# EAGLE schematic CAN_Base_V1 (EAGLE 9.7.0)
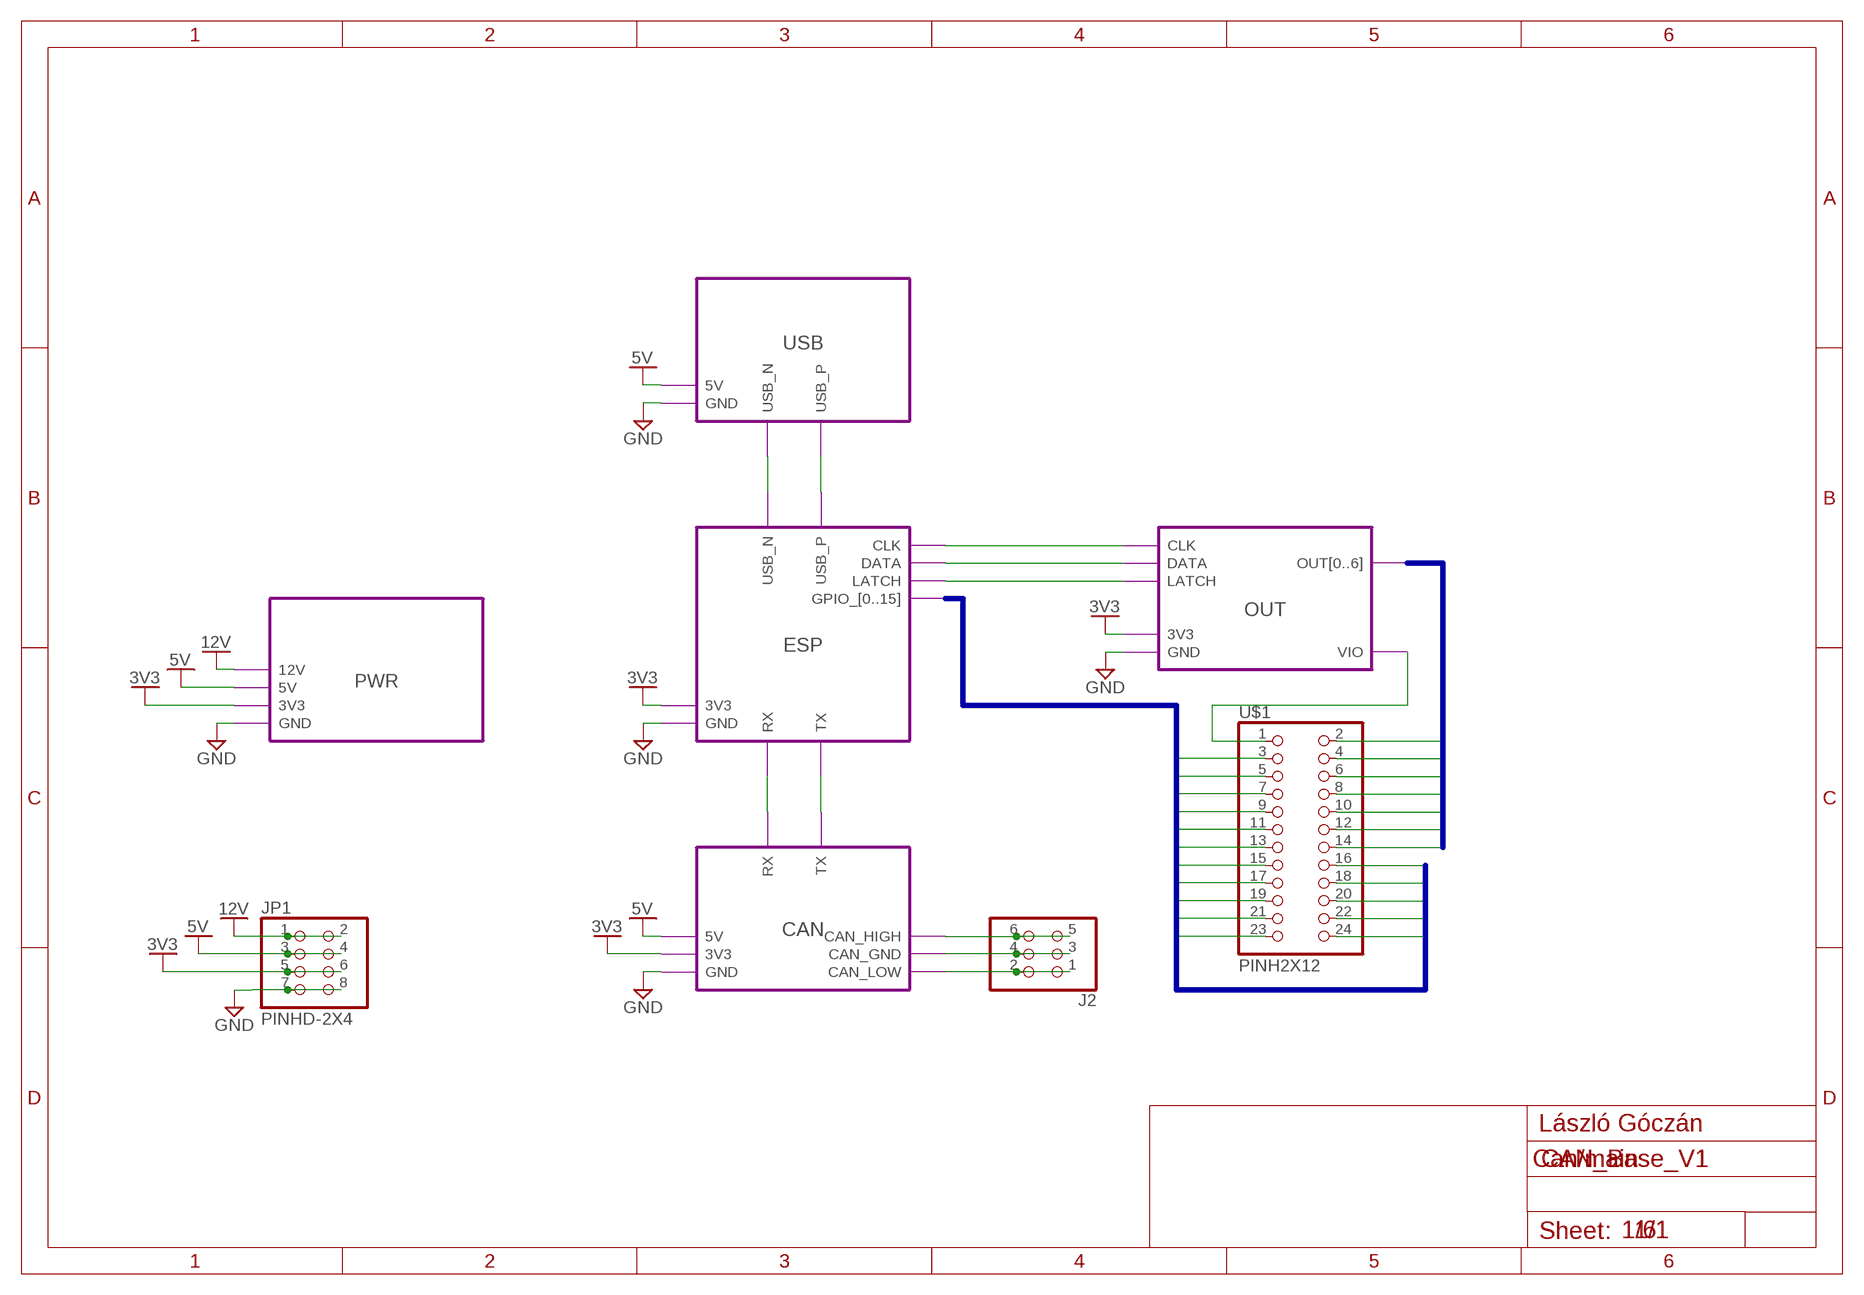
[diagram p0: schematic, sheet 1]

## Parts
J2  PINHD-2X3  [2X03]
JP1  PINHD-2X4  [2X04]
U$1  PINH2X12  [2X12]

## Module instances
ESP = ESP32_C6_WROOM_1_N8
USB = USB
CAN = CAN
OUT = 500MA_OUT_AND_7_SEGMENT
PWR = POWER

## Nets
3V3: JP1.5 JP1.6 ; port PWR.3V3 CAN.3V3 ESP.3V3 OUT.3V3
5V: JP1.3 JP1.4 ; port PWR.5V CAN.5V
12V: JP1.1 JP1.2 ; port PWR.12V
CAN_GND: J2.3 J2.4 ; port CAN.CAN_GND
CAN_HIGH: J2.5 J2.6 ; port CAN.CAN_HIGH
CAN_LOW: J2.1 J2.2 ; port CAN.CAN_LOW
GND: JP1.7 JP1.8 ; port PWR.GND ESP.GND CAN.GND USB.GND OUT.GND
GPIO0: U$1.16
GPIO1: U$1.18
GPIO2: U$1.20
GPIO3: U$1.22
GPIO4: U$1.24
GPIO5: U$1.23
GPIO6: U$1.21
GPIO7: U$1.19
GPIO8: U$1.17
GPIO9: U$1.15
GPIO10: U$1.13
GPIO11: U$1.11
GPIO12: U$1.9
GPIO13: U$1.7
GPIO14: U$1.5
GPIO15: U$1.3
N$1: U$1.1 ; port OUT.VIO
N$5: port ESP.CLK OUT.CLK
N$6: port ESP.DATA OUT.DATA
N$7: port ESP.LATCH OUT.LATCH
OUT0: U$1.2
OUT1: U$1.4
OUT2: U$1.6
OUT3: U$1.8
OUT4: U$1.10
OUT5: U$1.12
OUT6: U$1.14
RX: port CAN.RX ESP.RX
TX: port CAN.TX ESP.TX
USB_N: port USB.USB_N ESP.USB_N
USB_P: port ESP.USB_P USB.USB_P

## Buses
OUT[0..6]
GPIO[0..15]

## Notes on the sheet
- László Góczán
- Can/main
- 1/6

## Library data of the parts
J2 = SparkFun-Retired:PINHD-2X3: PIN HEADER
JP1 = Connector:PINHD-2X4: PIN HEADER; CATEGORY: Headers; DESCRIPTION: Header, Straight, 2x4 Position; MANUFACTURER: Generic; MPN: Generic; OPERATING_TEMPERATURE: Generic; PART_STATUS: Active; PITCH: 0.100" (2.54mm); ROHS_COMPLIANCE: Generic; SERIES: Generic; SUB-CATEGORY: Headers, Male Pins; TYPE: Board to Board or Cable, Unshrouded, Through Hole, Straight
U$1 = SparkFun-Retired:PINH2X12

## Module ESP32_C6_WROOM_1_N8
Ports: TX(io) RX(io) GND(pwr) 3V3(pwr) CLK(io) DATA(io) LATCH(io) GPIO_[0..15](io) USB_N(io) USB_P(io)
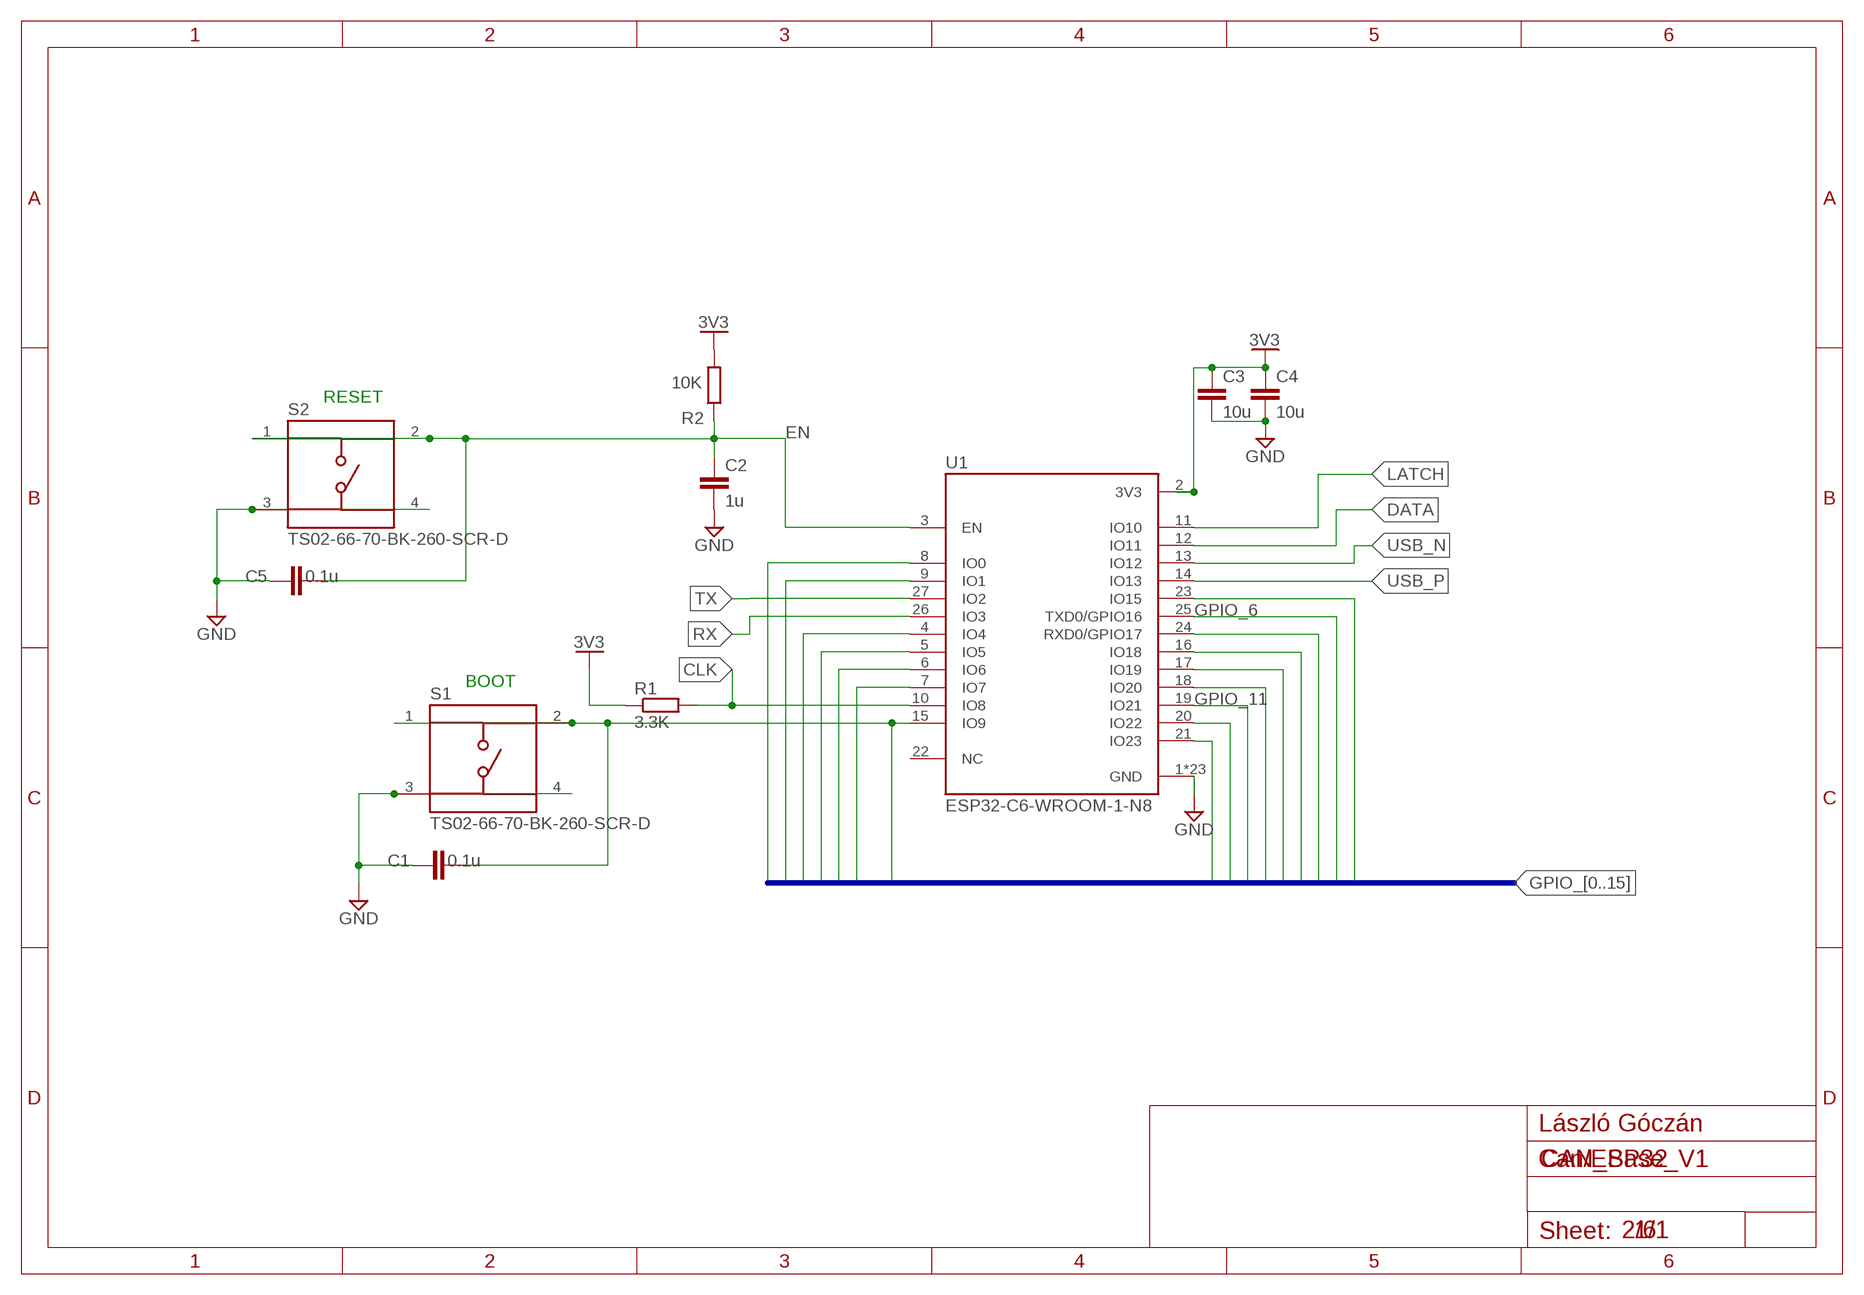
[diagram p1: schematic, module ESP32_C6_WROOM_1_N8, sheet 1]

### Parts
C1  0.1u  C-EUC0603  [C0603]
C2  1u  C-EUC0603  [C0603]
C3  10u  C-EUC0805  [C0805]
C4  10u  C-EUC0805  [C0805]
C5  0.1u  C-EUC0603  [C0603]
R1  3.3K  R-EU_R0603  [R0603]
R2  10K  R-EU_R0603  [R0603]
S1  TS02-66-70-BK-260-SCR-D  [SW_TS02-66-70-BK-260-SCR-D]
S2  TS02-66-70-BK-260-SCR-D  [SW_TS02-66-70-BK-260-SCR-D]
U1  ESP32-C6-WROOM-1-N8  [XCVR_ESP32-C6-WROOM-1-N8]

### Nets
3V3: C3.1 C4.1 R1.1 R2.2 U1.2(3V3)
CLK: R1.2 U1.10(IO8)
DATA: U1.12(IO11)
EN: C2.1 C5.2 R2.1 S2.1 S2.2 U1.3(EN)
GND: C1.1 C2.2 C3.2 C4.2 C5.1 S1.3 S1.4 S2.3 S2.4 U1.1(GND) U1.28(GND) U1.29_1(GND) U1.29_2(GND) U1.29_3(GND) U1.29_4(GND) U1.29_5(GND) U1.29_6(GND) U1.29_7(GND) U1.29_8(GND) U1.29_9(GND) U1.30_1(GND) U1.30_2(GND) U1.30_3(GND) U1.30_4(GND) U1.30_5(GND) U1.30_6(GND) U1.30_7(GND) U1.30_8(GND) U1.30_9(GND) U1.30_10(GND) U1.30_11(GND) U1.30_12(GND)
GPIO_0: U1.9(IO1)
GPIO_1: U1.8(IO0)
GPIO_2: U1.7(IO7)
GPIO_3: U1.6(IO6)
GPIO_4: U1.5(IO5)
GPIO_5: U1.4(IO4)
GPIO_6: U1.25(TXD0/GPIO16)
GPIO_7: C1.2 S1.1 S1.2 U1.15(IO9)
GPIO_8: U1.16(IO18)
GPIO_9: U1.17(IO19)
GPIO_10: U1.18(IO20)
GPIO_11: U1.19(IO21)
GPIO_12: U1.20(IO22)
GPIO_13: U1.21(IO23)
GPIO_14: U1.23(IO15)
GPIO_15: U1.24(RXD0/GPIO17)
LATCH: U1.11(IO10)
RX: U1.26(IO3)
TX: U1.27(IO2)
USB_N: U1.13(IO12)
USB_P: U1.14(IO13)
Unconnected: U1.22(NC)

### Buses
GPIO_[0..15]

### Notes on the sheet
- RESET
- BOOT
- László Góczán
- Can/ESP32
- 2/6

### Library data of the parts
C1-C5 = resistor:C-EU: CAPACITOR, European symbol
R1 R2 = resistor:R-EU_: RESISTOR, European symbol
S1 S2 = TS02-66-70-BK-260-SCR-D:TS02-66-70-BK-260-SCR-D: Check availability; AVAILABILITY: In Stock; CHECK_PRICES: https://www.snapeda.com/parts/TS02-66-70-BK-260-SCR-D/CUI+Devices/view-part/?ref=eda; CUI_PURCHASE_URL: https://www.cuidevices.com/product/switches/tactile-switches/ts02-66-70-bk-260-scr-d?utm_source=snapeda.com&utm_medium=referral&utm_campaign=snapedaBOM; DESCRIPTION: 6 x 6 mm, 7 mm Actuator Height, 260 gf, Black, Short Crimped, Through Hole, SPST, Tactile Switch; MF: CUI Devices; MP: TS02-66-70-BK-260-SCR-D; PACKAGE: None; PRICE: None; PURCHASE-URL: https://www.snapeda.com/api/url_track_click_mouser/?unipart_id=8666189&manufacturer=CUI Devices&part_name=TS02-66-70-BK-260-SCR-D&search_term=ts02-66; SNAPEDA_LINK: https://www.snapeda.com/parts/TS02-66-70-BK-260-SCR-D/CUI+Devices/view-part/?ref=snap
U1 = ESP32-FIXED:ESP32-C6-WROOM-1-N8: Check availability; AVAILABILITY: In Stock; CHECK_PRICES: https://www.snapeda.com/parts/ESP32-C6-WROOM-1-N8/Espressif+Systems/view-part/?ref=eda; DESCRIPTION: Multiprotocol Modules ESP32-C6 module, Wi-Fi 6 in 2.4 GHz band, Bluetooth 5, Zigbee 3.0 and Thread. ESP34-WROOM Compatible - ENGINEERING SAMPLE; MF: Espressif Systems; MP: ESP32-C6-WROOM-1-N8; PACKAGE: None; PRICE: None; PURCHASE-URL: https://www.snapeda.com/api/url_track_click_mouser/?unipart_id=12616380&manufacturer=Espressif Systems&part_name=ESP32-C6-WROOM-1-N8&search_term=esp32 c6 wroom; SNAPEDA_LINK: https://www.snapeda.com/parts/ESP32-C6-WROOM-1-N8/Espressif+Systems/view-part/?ref=snap

## Module ESP32_C6
Ports: 

### Library data of the parts

## Module USB
Ports: GND(pwr) 5V(pwr) USB_P(io) USB_N(io)
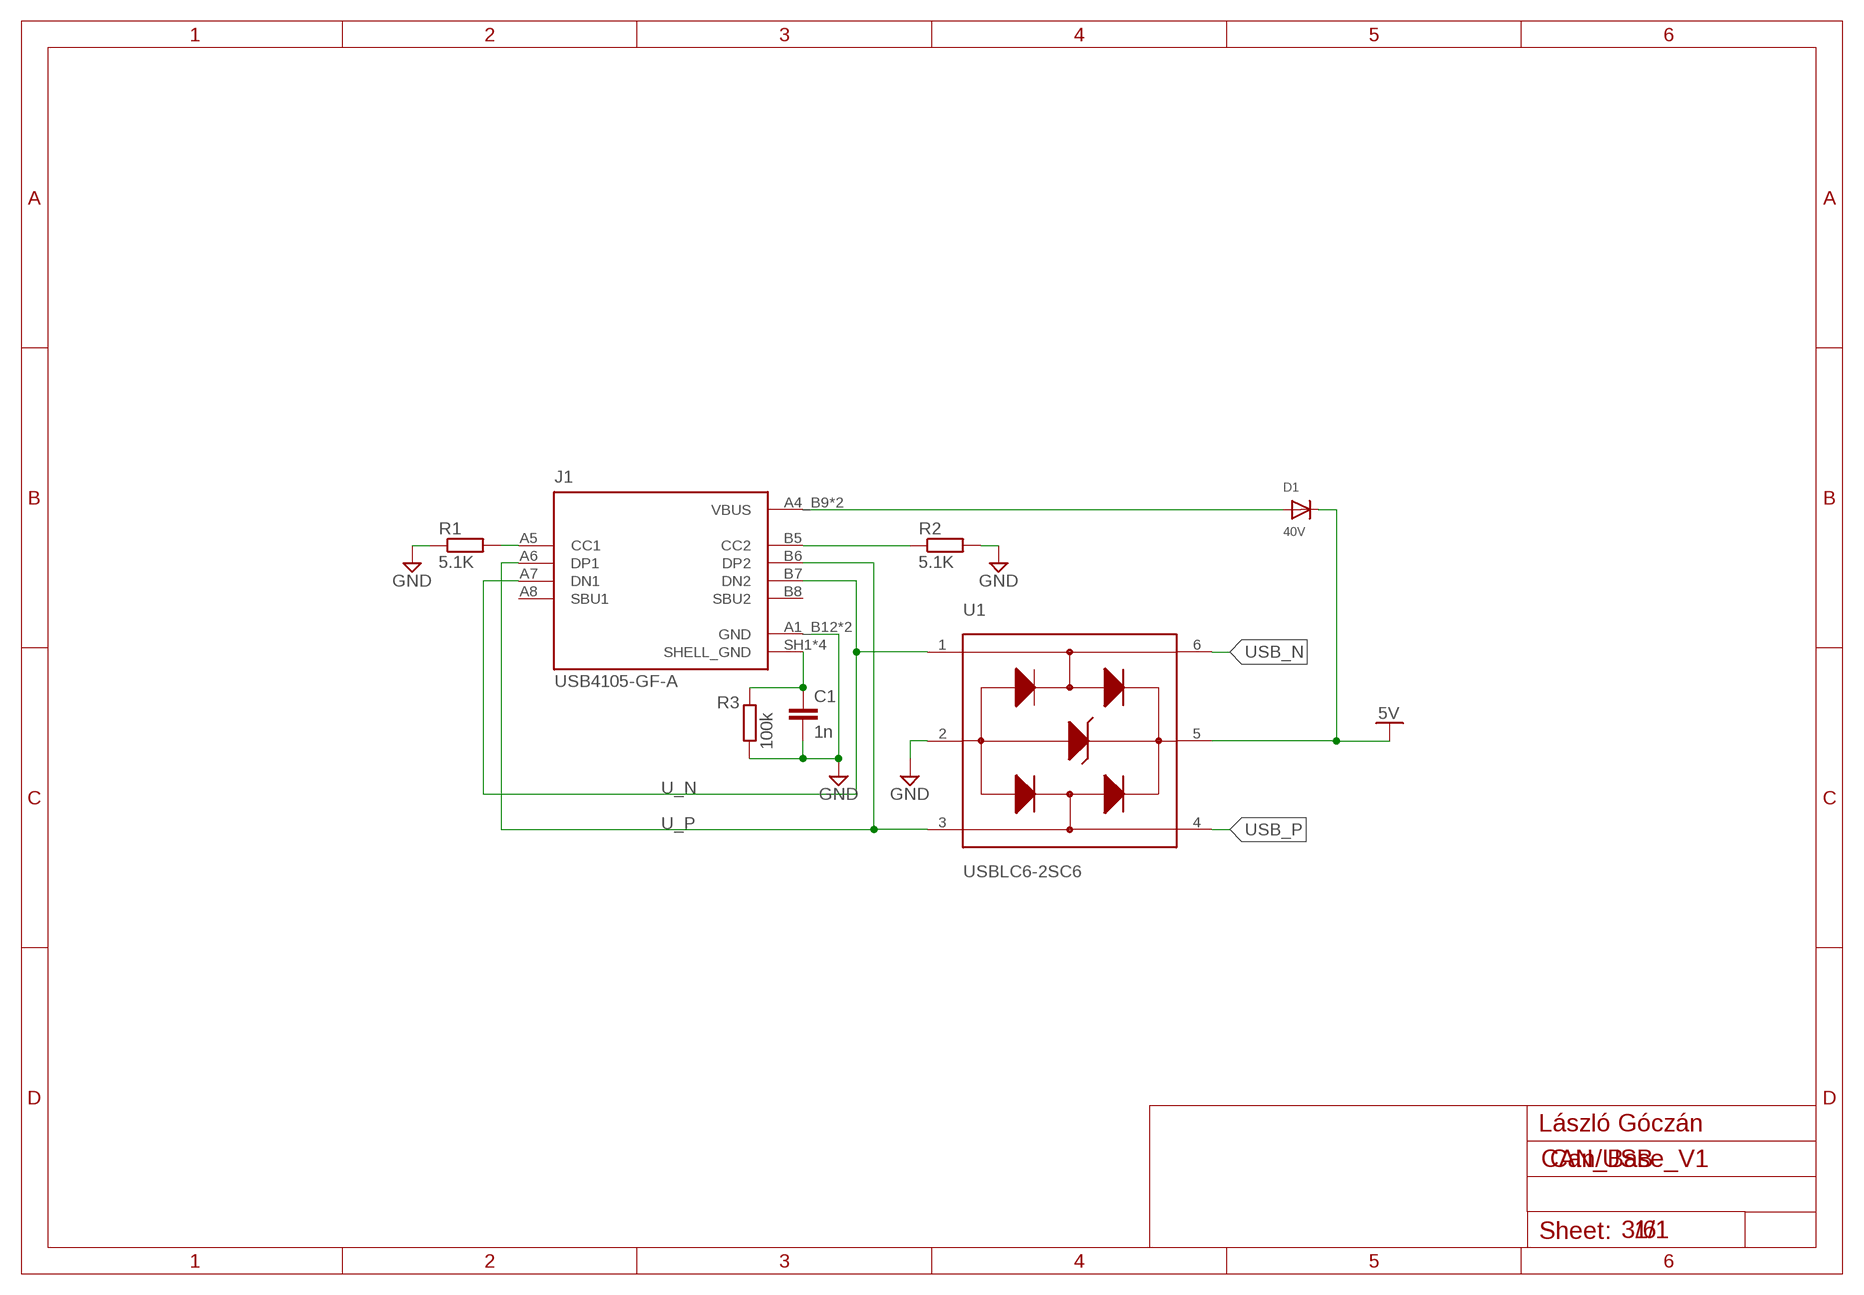
[diagram p2: schematic, module USB, sheet 1]

### Parts
C1  1n  C-EUC0603  [C0603]
D1  40V  DIODESOD-123  [SOD-123]
J1  USB4105-GF-A  [GCT_USB4105-GF-A]
R1  5.1K  R-EU_R0603  [R0603]
R2  5.1K  R-EU_R0603  [R0603]
R3  100k  R-EU_R0603  [R0603]
U1  USBLC6-2SC6  [SOT95P280X145-6N]

### Nets
5V: D1.C U1.5(VBUS)
GND: C1.2 J1.A1_B12(GND) J1.B1_A12(GND) R1.1 R2.2 R3.1 U1.2(GND)
N$1: J1.A5(CC1) R1.2
N$2: J1.B5(CC2) R2.1
N$5: D1.A J1.A4_B9(VBUS) J1.B4_A9(VBUS)
N$6: C1.1 J1.SH1(SHELL_GND) J1.SH2(SHELL_GND) J1.SH3(SHELL_GND) J1.SH4(SHELL_GND) R3.2
U_N: J1.A7(DN1) J1.B7(DN2) U1.1(I/O1_IN)
U_P: J1.A6(DP1) J1.B6(DP2) U1.3(I/O2_IN)
USB_N: U1.6(I/O1_OUT)
USB_P: U1.4(I/O2_OUT)
Unconnected: J1.A8(SBU1) J1.B8(SBU2)

### Notes on the sheet
- László Góczán
- Can/USB
- 3/6

### Library data of the parts
C1 = resistor:C-EU: CAPACITOR, European symbol
D1 = Tubescreamer:DIODE: Diode SMADIODE - SMA Surface Mount Package 20V 1A Schottky Diode Digikey: 641-1014-6-ND DO-1N4148 - Through Hole Small Current Diode SOD-123 20V 1 A (.5mV Vf) Schottky Diode - Digikey: MBRX120TPMSCT-ND SOD-323 10V 570mA (.38mV Vf, 3ns) Schottky Diode - Digikey: ZLLS410CT-ND SOD-523 30V 30mA Schottky Diode (RB751S-40TE61) - Digikey: RB751S-40TE61CT-ND SOT23-R/W - SOT23 Package (R = Solder Paste/Reflow Ovens, W = Hand-Soldering) BAT54Film 40V 300mA - Digikey: 497-7162-1-ND
J1 = USB4105-GF-A:USB4105-GF-A: Check availability; AVAILABILITY: In Stock; CHECK_PRICES: https://www.snapeda.com/parts/USB4105-GF-A/Global+Connector+Technology/view-part/?ref=eda; DESCRIPTION: USB-C (USB TYPE-C) USB 2.0 Receptacle Connector 24 (16+8 Dummy) Position Surface Mount, Right Angle; Through Hole; MF: GCT; MP: USB4105-GF-A; PACKAGE: None; PRICE: None; PURCHASE-URL: https://www.snapeda.com/api/url_track_click_mouser/?unipart_id=4423780&manufacturer=GCT&part_name=USB4105-GF-A&search_term=usb4105-gf-a; SNAPEDA_LINK: https://www.snapeda.com/parts/USB4105-GF-A/Global+Connector+Technology/view-part/?ref=snap
R1-R3 = resistor:R-EU_: RESISTOR, European symbol
U1 = USBLC6-2SC6:USBLC6-2SC6: Check availability Check availability Check availability; AVAILABILITY: In Stock; CHECK_PRICES: https://www.snapeda.com/parts/USBLC6-2SC6/STMicroelectronics/view-part/?ref=eda; DESCRIPTION: 17V Clamp 5A (8/20µs) Ipp Tvs Diode Surface Mount SOT-23-6; MF: STMicroelectronics; MP: USBLC6-2SC6; PACKAGE: SOT-23-6 STMicroelectronics; PRICE: None; PURCHASE-URL: https://www.snapeda.com/api/url_track_click_mouser/?unipart_id=231887&manufacturer=STMicroelectronics&part_name=USBLC6-2SC6&search_term=usblc6-2sc6; SNAPEDA_LINK: https://www.snapeda.com/parts/USBLC6-2SC6/STMicroelectronics/view-part/?ref=snap

## Module CAN
Ports: 3V3(pwr) GND(pwr) RX(io) TX(io) 5V(pwr) CAN_HIGH(io) CAN_GND(io) CAN_LOW(io)
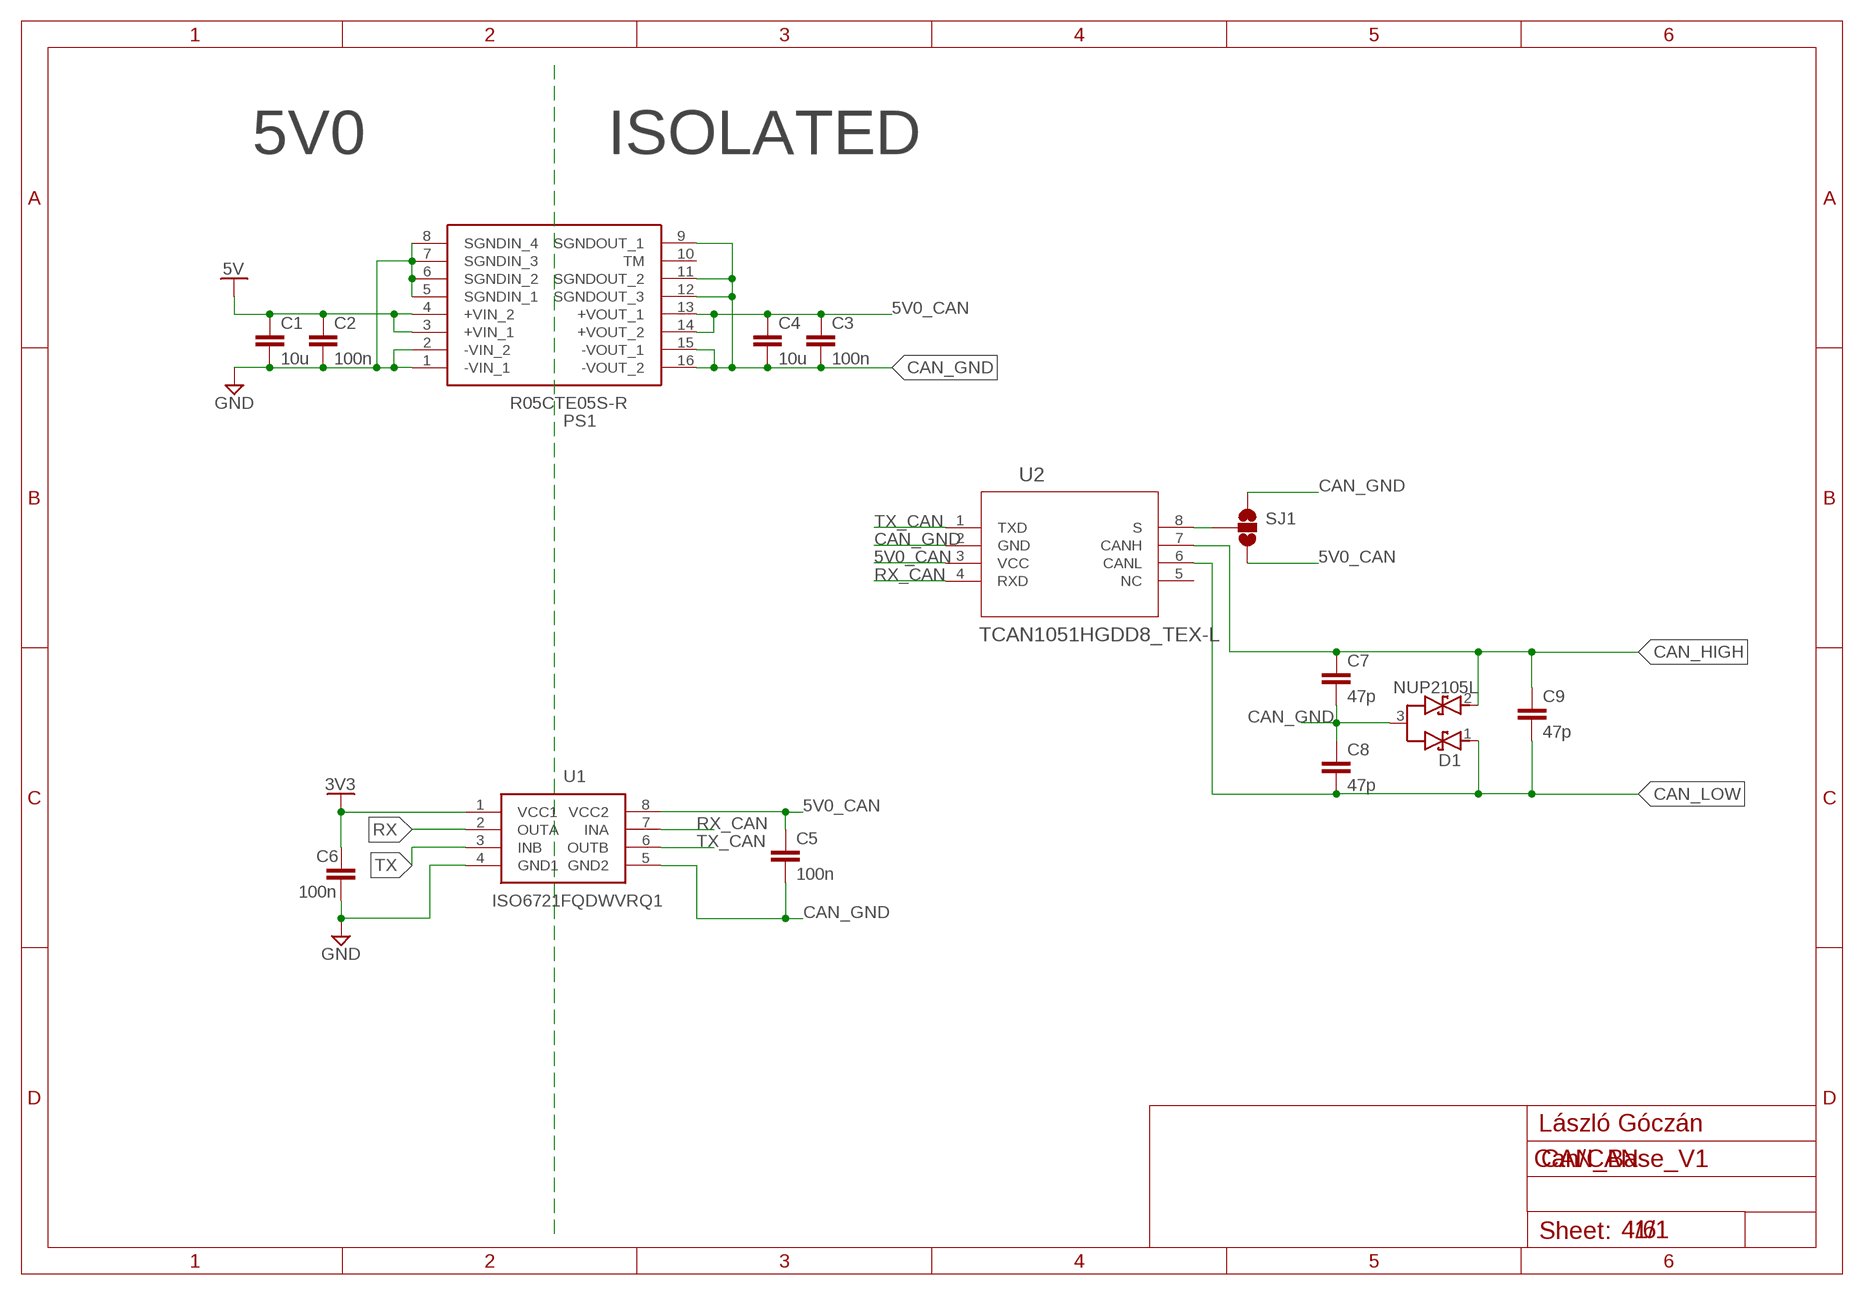
[diagram p3: schematic, module CAN, sheet 1]

### Parts
C1  10u  C-EUC0805  [C0805]
C2  100n  C-EUC0603  [C0603]
C3  100n  C-EUC0603  [C0603]
C4  10u  C-EUC0805  [C0805]
C5  100n  C-EUC0603  [C0603]
C6  100n  C-EUC0603  [C0603]
C7  47p  C-EUC0603  [C0603]
C8  47p  C-EUC0603  [C0603]
C9  47p  C-EUC0603  [C0603]
D1  NUP2105L  [SOT23]
PS1  R05CTE05S-R  [SOIC127P1030X265-16N]
SJ1  SOLDERJUMPER_2WAYW  [SJ_2W]
U1  ISO6721FQDWVRQ1  [SOIC127P1150X280-8N]
U2  TCAN1051HGDD8_TEX-L  [D8_TEX-L]

### Nets
3V3: C6.1 U1.1(VCC1)
5V: C1.1 C2.1 PS1.3(+VIN_1) PS1.4(+VIN_2)
5V0_CAN: C3.1 C4.1 C5.1 PS1.13(+VOUT_1) PS1.14(+VOUT_2) SJ1.3 U1.8(VCC2) U2.3(VCC)
CAN_GND: C3.2 C4.2 C5.2 C7.2 C8.1 D1.3 PS1.9(SGNDOUT_1) PS1.11(SGNDOUT_2) PS1.12(SGNDOUT_3) PS1.15(-VOUT_1) PS1.16(-VOUT_2) SJ1.1 U1.5(GND2) U2.2(GND)
CAN_HIGH: C7.1 C9.1 D1.2 U2.7(CANH)
CAN_LOW: C8.2 C9.2 D1.1 U2.6(CANL)
GND: C1.2 C2.2 C6.2 PS1.1(-VIN_1) PS1.2(-VIN_2) PS1.5(SGNDIN_1) PS1.6(SGNDIN_2) PS1.7(SGNDIN_3) PS1.8(SGNDIN_4) U1.4(GND1)
N$1: SJ1.2 U2.8(S)
RX: U1.2(OUTA)
RX_CAN: U1.7(INA) U2.4(RXD)
TX: U1.3(INB)
TX_CAN: U1.6(OUTB) U2.1(TXD)
Unconnected: PS1.10(TM) U2.5(NC)

### Notes on the sheet
- 5V0 | ISOLATED
- László Góczán
- Can/CAN
- 4/6

### Library data of the parts
C1-C9 = resistor:C-EU: CAPACITOR, European symbol
D1 = NUP2105L:NUP2105L: Suppresseurs ESD / Diodes TVS ESD Doc constructeur GEII/IUT ANGERS Check availability; AVAILABILITY: In Stock; CHECK_PRICES: https://www.snapeda.com/parts/NUP2105L/Diotec/view-part/?ref=eda; DESCRIPTION: ESD, SOT-23, 0.1A, 24V, Unidir; MF: Diotec Semiconductor; MP: NUP2105L; PACKAGE: SOT-23-3 Diotec; PRICE: None; PURCHASE-URL: https://www.snapeda.com/api/url_track_click_mouser/?unipart_id=5164164&manufacturer=Diotec Semiconductor&part_name=NUP2105L&search_term=nup2105l; SNAPEDA_LINK: https://www.snapeda.com/parts/NUP2105L/Diotec/view-part/?ref=snap
PS1 = R05CTE05S-R:R05CTE05S-R: 1 Watt 16-Pin SOIC Single Output, 5VDC, Tape & Reel Source: Datasheet; DESCRIPTION: 1 Watt 16-Pin SOIC Single Output, 5VDC, Tape & Reel; HEIGHT: 2.65mm; MANUFACTURER_NAME: RECOM Power; MANUFACTURER_PART_NUMBER: R05CTE05S-R; MOUSER_PART_NUMBER: 919-R05CTE05S-R; MOUSER_PRICE-STOCK: https://www.mouser.co.uk/ProductDetail/RECOM-Power/R05CTE05S-R?qs=7D1LtPJG0i0SUCKLd%252BnSSQ%3D%3D
SJ1 = SparkFun-Retired:SOLDERJUMPER_2WAY: Solder Jumper 2 way solder jumper
U1 = ISO6721FQDWVRQ1:ISO6721FQDWVRQ1: Digital Isolators Automotive, general-purpose, dual-channel, 1/1 digital isolator Source: Datasheet; DESCRIPTION: Digital Isolators Automotive, general-purpose, dual-channel, 1/1 digital isolator; HEIGHT: 2.8mm; MANUFACTURER_NAME: Texas Instruments; MANUFACTURER_PART_NUMBER: ISO6721FQDWVRQ1; MOUSER_PART_NUMBER: 595-ISO6721FQDWVRQ1; MOUSER_PRICE-STOCK: https://www.mouser.co.uk/ProductDetail/Texas-Instruments/ISO6721FQDWVRQ1?qs=TuK3vfAjtkVdnWQ4lceCiA%3D%3D
U2 = 2024-02-16_18-01-42_Library:TCAN1051HGD; COPYRIGHT: Copyright (C) 2024 Ultra Librarian. All rights reserved.; MANUFACTURER_PART_NUMBER: TCAN1051HGD; MFR_NAME: Texas Instruments

## Module 500MA_OUT_AND_7_SEGMENT
Ports: GND(pwr) 3V3(pwr) CLK(io) DATA(io) LATCH(io) OUT[0..6](out) VIO(pwr)
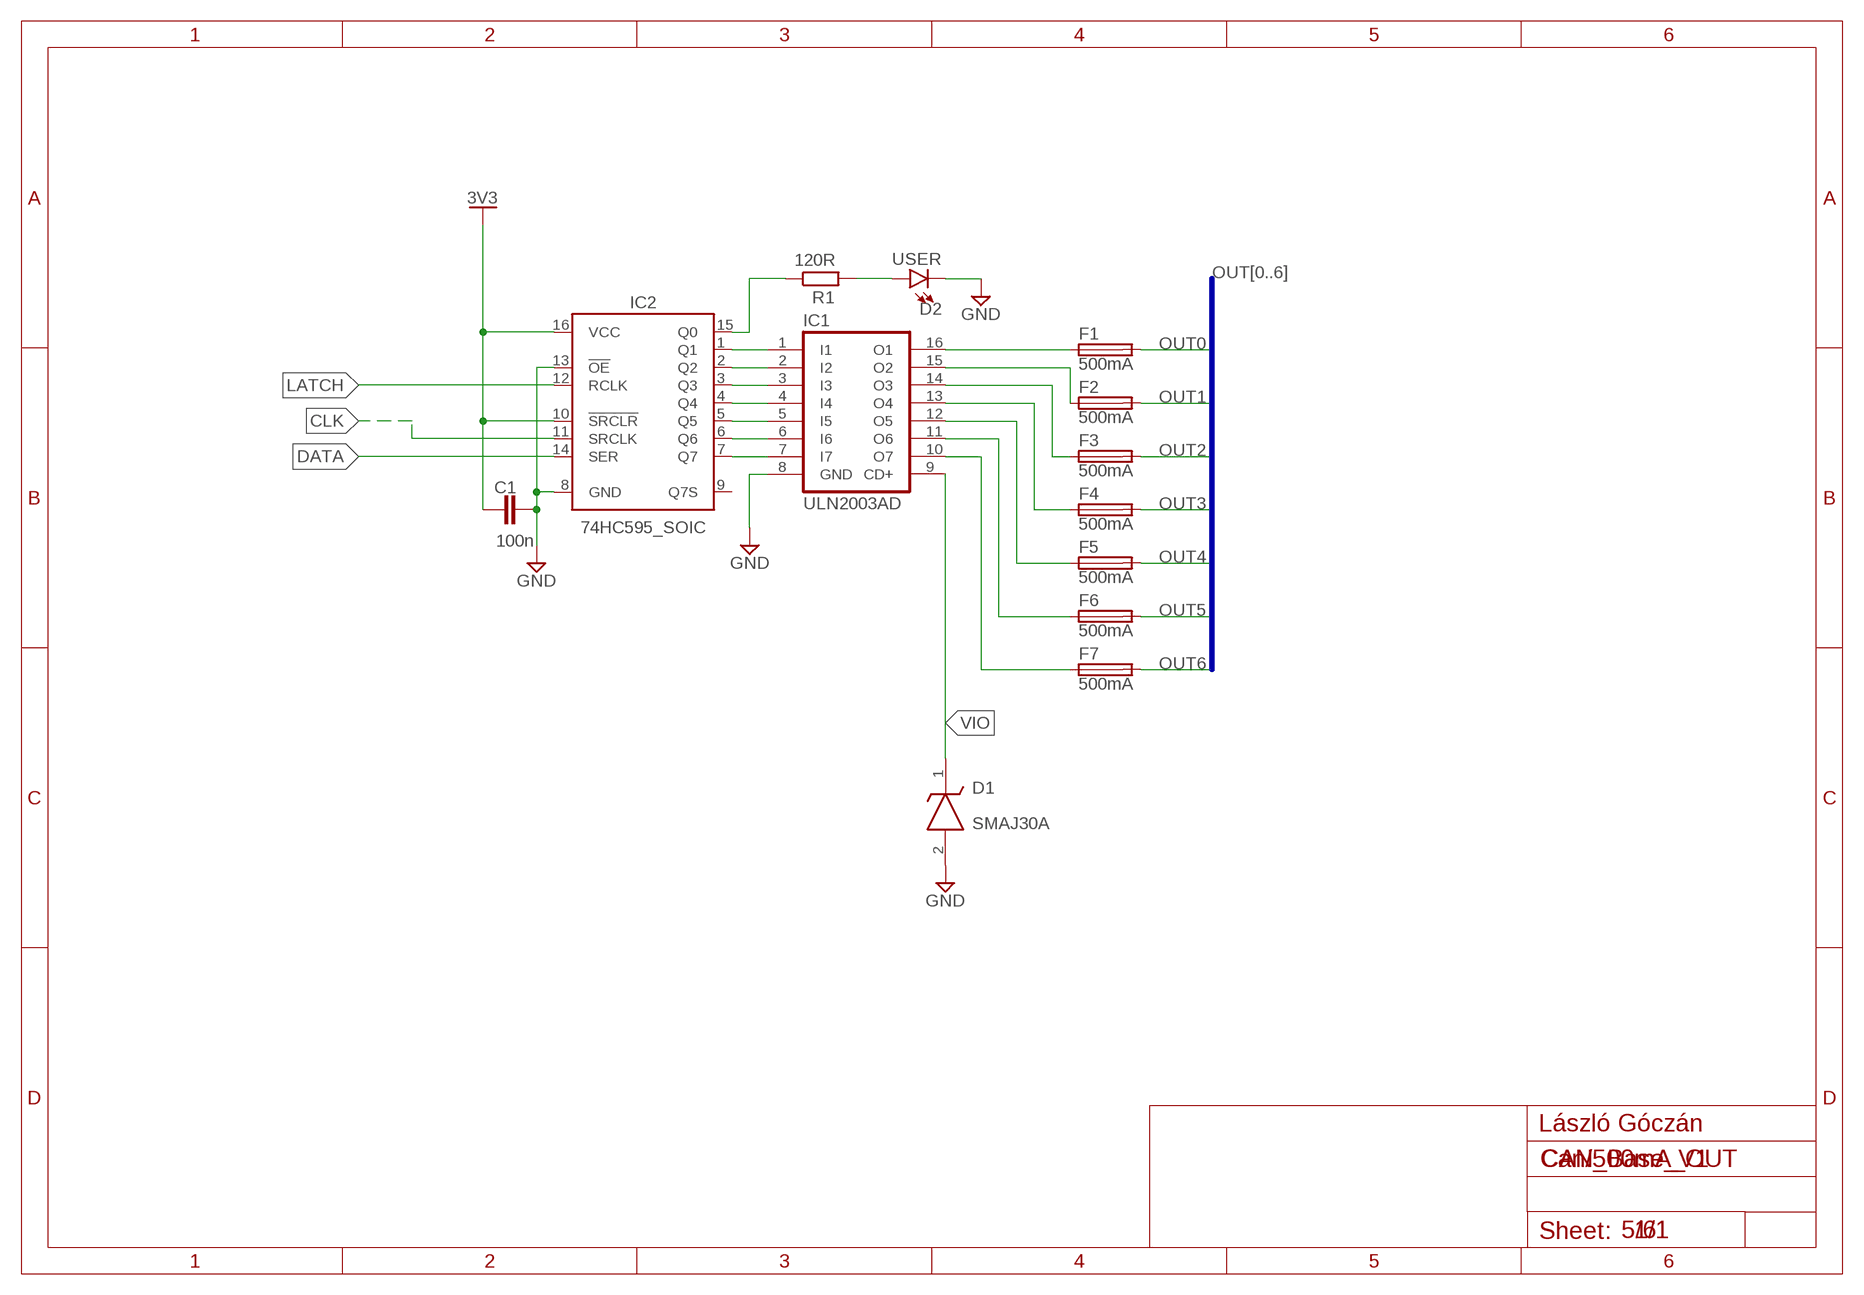
[diagram p4: schematic, module 500MA_OUT_AND_7_SEGMENT, sheet 1]

### Parts
C1  100n  C-EUC0603  [C0603]
D1  SMAJ30A  [DIOM5026X229N]
D2  USER  LED-BLUE0603  [LED-0603]
F1  500mA  FUSE_CHIP-1206(3216-METRIC)  [FUSC3215X82N]
F2  500mA  FUSE_CHIP-1206(3216-METRIC)  [FUSC3215X82N]
F3  500mA  FUSE_CHIP-1206(3216-METRIC)  [FUSC3215X82N]
F4  500mA  FUSE_CHIP-1206(3216-METRIC)  [FUSC3215X82N]
F5  500mA  FUSE_CHIP-1206(3216-METRIC)  [FUSC3215X82N]
F6  500mA  FUSE_CHIP-1206(3216-METRIC)  [FUSC3215X82N]
F7  500mA  FUSE_CHIP-1206(3216-METRIC)  [FUSC3215X82N]
IC1  ULN2003AD  [SO16]
IC2  74HC595_SOIC  [SOIC127P600X175-16N]
R1  120R  R-EU_R0603  [R0603]

### Nets
3V3: C1.1 IC2.10(!SRCLR) IC2.16(VCC)
CLK: IC2.11(SRCLK)
DATA: IC2.14(SER)
GND: C1.2 D1.2(A) D2.C IC1.8(GND) IC2.8(GND) IC2.13(!OE)
LATCH: IC2.12(RCLK)
N$1: F1.1 IC1.16(O1)
N$2: F2.1 IC1.15(O2)
N$3: F3.1 IC1.14(O3)
N$4: F4.1 IC1.13(O4)
N$5: F5.1 IC1.12(O5)
N$6: F6.1 IC1.11(O6)
N$7: F7.1 IC1.10(O7)
N$8: IC1.1(I1) IC2.1(Q1)
N$9: IC1.2(I2) IC2.2(Q2)
N$10: IC1.3(I3) IC2.3(Q3)
N$11: IC1.4(I4) IC2.4(Q4)
N$12: IC1.5(I5) IC2.5(Q5)
N$13: IC1.6(I6) IC2.6(Q6)
N$14: IC1.7(I7) IC2.7(Q7)
N$31: IC2.15(Q0) R1.1
N$35: D2.A R1.2
OUT0: F1.2
OUT1: F2.2
OUT2: F3.2
OUT3: F4.2
OUT4: F5.2
OUT5: F6.2
OUT6: F7.2
VIO: D1.1(K) IC1.9(CD+)
Unconnected: IC2.9(Q7S)

### Buses
OUT[0..6]

### Notes on the sheet
- László Góczán
- Can/500mA_OUT
- 5/6

### Library data of the parts
C1 = resistor:C-EU: CAPACITOR, European symbol
D1 = SMAJ30A:SMAJ30A: ESD Suppressors / TVS Diodes 400W 30V 5% Uni-Directional Source: Datasheet; DESCRIPTION: ESD Suppressors / TVS Diodes 400W 30V 5% Uni-Directional; HEIGHT: 2.29mm; MANUFACTURER_NAME: LITTELFUSE; MANUFACTURER_PART_NUMBER: SMAJ30A; MOUSER_PART_NUMBER: 576-SMAJ30A; MOUSER_PRICE-STOCK: https://www.mouser.co.uk/ProductDetail/Littelfuse/SMAJ30A?qs=JJML70Qc14tOmIOtllb78g%3D%3D
D2 = SparkFun-LED:LED-BLUE: Blue SMD LED Used in manufacturing of various products at SparkFun Packages: 0603 - SMD 0603 package [Product Link] <http://www.digikey.com/product-detail/en/SMLE12BC7TT86/511-1589-2-ND/1641808> 1206 - SMD1206 package [Product Link] <http://www.digikey.com/product-detail/en/lite-on-inc/LTST-C150TBKT/160-1643-1-ND/573584> SparkFun Products: ESP8266 Thing-Dev Board <https://www.sparkfun.com/products/13711> RedBoard <https://www.sparkfun.com/products/12757>; PROD_ID: DIO-08575; VALUE: BLUE
F1-F7 = Circuit-Protection:FUSE: Fuse - Generic; CATEGORY: Circuit-Protection; SUB-CATEGORY: Fuse
IC1 = uln-udn:ULN2003A: DRIVER ARRAY
IC2 = IC_Logic:74HC595: 8-Bit Shift Registers Reference Datasheet; CATEGORY: IC_Logic; DESCRIPTION: 8-Bit Shift Registers; MANUFACTURER: Generic; MPN: Generic; SUB-CATEGORY: Shift Register; TYPE: 8-Bit
R1 = resistor:R-EU_: RESISTOR, European symbol

## Module POWER
Ports: 12V(pwr) 3V3(pwr) GND(pwr) 5V(pwr)
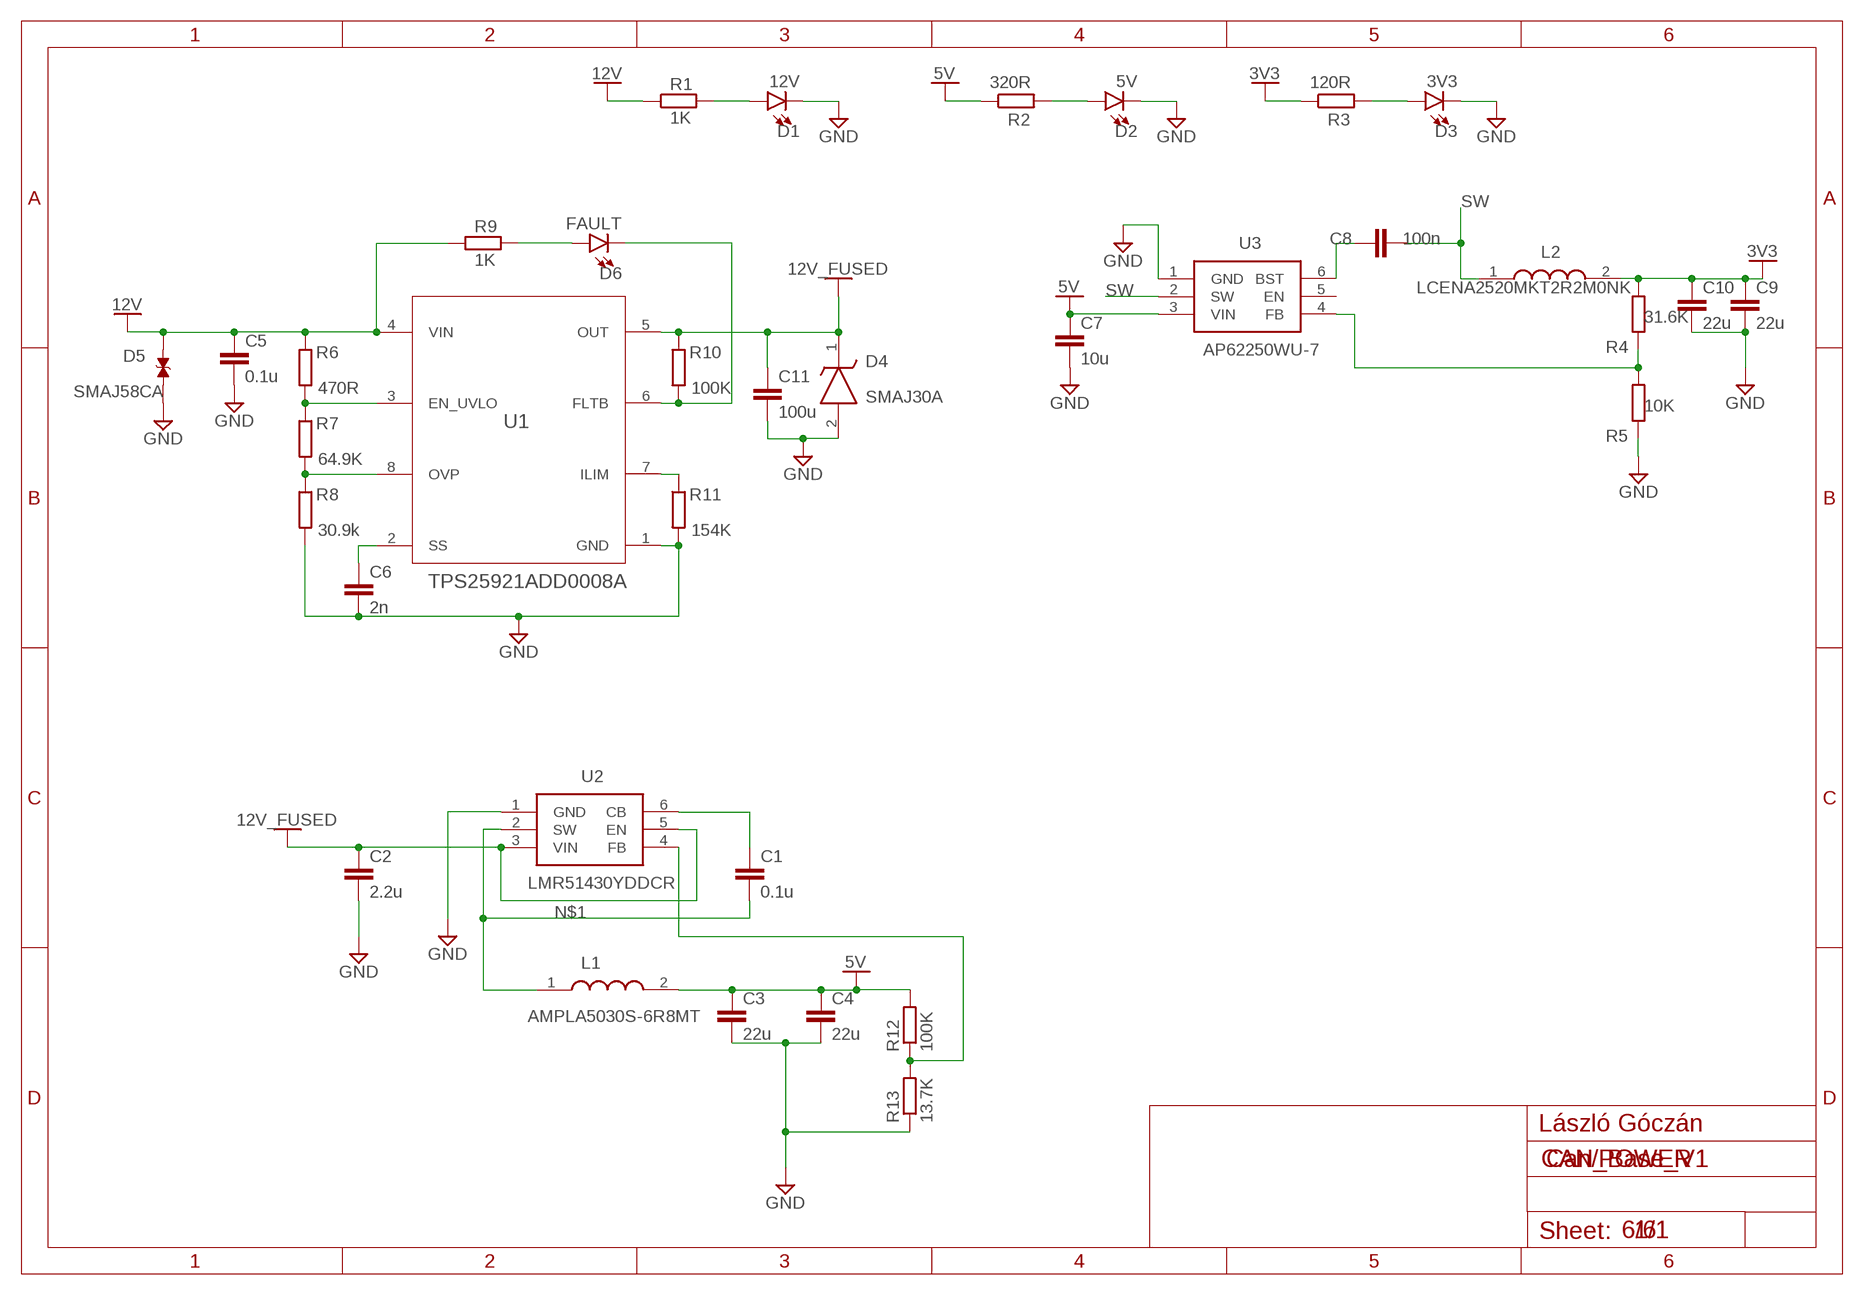
[diagram p5: schematic, module POWER, sheet 1]

### Parts
C1  0.1u  C-EUC0603  [C0603]
C2  2.2u  C-EUC0805  [C0805]
C3  22u  C-EUC0805  [C0805]
C4  22u  C-EUC0805  [C0805]
C5  0.1u  C-EUC0603  [C0603]
C6  2n  C-EUC0603  [C0603]
C7  10u  C-EUC0805  [C0805]
C8  100n  C-EUC0603  [C0603]
C9  22u  C-EUC0805  [C0805]
C10  22u  C-EUC0805  [C0805]
C11  100u  C-EUC1206  [C1206]
D1  12V  LED-BLUE0603  [LED-0603]
D2  5V  LED-BLUE0603  [LED-0603]
D3  3V3  LED-BLUE0603  [LED-0603]
D4  SMAJ30A  [DIOM5026X229N]
D5  SMAJ58CA  [DIOM4325X250N]
D6  FAULT  LED-BLUE0603  [LED-0603]
L1  AMPLA5030S-6R8MT  [INDPM5752X300M]
L2  LCENA2520MKT2R2M0NK  [LCENA2520]
R1  1K  R-EU_R0603  [R0603]
R2  320R  R-EU_R0603  [R0603]
R3  120R  R-EU_R0603  [R0603]
R4  31.6K  R-EU_R0603  [R0603]
R5  10K  R-EU_R0603  [R0603]
R6  470R  R-EU_R0603  [R0603]
R7  64.9K  R-EU_R0603  [R0603]
R8  30.9k  R-EU_R0603  [R0603]
R9  1K  R-EU_R0603  [R0603]
R10  100K  R-EU_R0603  [R0603]
R11  154K  R-EU_R0603  [R0603]
R12  100K  R-EU_R0603  [R0603]
R13  13.7K  R-EU_R0603  [R0603]
U1  TPS25921ADD0008A  [D0008A]
U2  LMR51430YDDCR  [SOT95P280X110-6N]
U3  AP62250WU-7  [SOT95P280X100-6N]

### Nets
3V3: C9.1 C10.1 L2.2 R3.1 R4.2
5V: C3.1 C4.1 C7.1 L1.2 R2.1 R12.2 U3.3(VIN)
12V: C5.1 D5.2 R1.1 R6.1 R9.1 U1.4(VIN)
12V_FUSED: C2.1 C11.1 D4.1(K) R10.1 U1.5(OUT) U2.3(VIN) U2.5(EN)
GND: C2.2 C3.2 C4.2 C5.2 C6.2 C7.2 C9.2 C10.2 C11.2 D1.C D2.C D3.C D4.2(A) D5.1 R5.1 R8.2 R11.2 R13.1 U1.1(GND) U2.1(GND) U3.1(GND)
N$1: C1.2 L1.1 U2.2(SW)
N$2: C1.1 U2.6(CB)
N$3: R12.1 R13.2 U2.4(FB)
N$4: C8.1 U3.6(BST)
N$5: D6.A R9.2
N$6: D1.A R1.2
N$7: D2.A R2.2
N$11: R4.1 R5.2 U3.4(FB)
N$12: R6.2 R7.1 U1.3(EN_UVLO)
N$13: R7.2 R8.1 U1.8(OVP)
N$14: R11.1 U1.7(ILIM)
N$15: C6.1 U1.2(SS)
N$17: D6.C R10.2 U1.6(FLTB)
N$35: D3.A R3.2
SW: C8.2 L2.1 U3.2(SW)
Unconnected: U3.5(EN)

### Notes on the sheet
- László Góczán
- Can/POWER
- 6/6

### Library data of the parts
C1-C11 = resistor:C-EU: CAPACITOR, European symbol
D1-D3 D6 = SparkFun-LED:LED-BLUE: Blue SMD LED Used in manufacturing of various products at SparkFun Packages: 0603 - SMD 0603 package [Product Link] <http://www.digikey.com/product-detail/en/SMLE12BC7TT86/511-1589-2-ND/1641808> 1206 - SMD1206 package [Product Link] <http://www.digikey.com/product-detail/en/lite-on-inc/LTST-C150TBKT/160-1643-1-ND/573584> SparkFun Products: ESP8266 Thing-Dev Board <https://www.sparkfun.com/products/13711> RedBoard <https://www.sparkfun.com/products/12757>; PROD_ID: DIO-08575; VALUE: BLUE
D4 = SMAJ30A:SMAJ30A: ESD Suppressors / TVS Diodes 400W 30V 5% Uni-Directional Source: Datasheet; DESCRIPTION: ESD Suppressors / TVS Diodes 400W 30V 5% Uni-Directional; HEIGHT: 2.29mm; MANUFACTURER_NAME: LITTELFUSE; MANUFACTURER_PART_NUMBER: SMAJ30A; MOUSER_PART_NUMBER: 576-SMAJ30A; MOUSER_PRICE-STOCK: https://www.mouser.co.uk/ProductDetail/Littelfuse/SMAJ30A?qs=JJML70Qc14tOmIOtllb78g%3D%3D
D5 = SMAJ58CA:SMAJ58CA: Check availability; AVAILABILITY: In Stock; CHECK_PRICES: https://www.snapeda.com/parts/SMAJ58CA/Taiwan+Semiconductor/view-part/?ref=eda; DESCRIPTION: 400W, 67.8V, 5%, Bidirectional, TVS; MF: Taiwan Semiconductor; MP: SMAJ58CA; PACKAGE: SMA Taiwan Semiconductor; PRICE: None; SNAPEDA_LINK: https://www.snapeda.com/parts/SMAJ58CA/Taiwan+Semiconductor/view-part/?ref=snap
L1 = AMPLA5030S-6R8MT:AMPLA5030S-6R8MT: Inductor Power Shielded/Molded Wirewound 6.8uH 20% 100KHz Carbonyl Powder 4A 0.0762Ohm DCR 2220 T/R Source: Datasheet; DESCRIPTION: Inductor Power Shielded/Molded Wirewound 6.8uH 20% 100KHz Carbonyl Powder 4A 0.0762Ohm DCR 2220 T/R; HEIGHT: 3mm; MANUFACTURER_NAME: ABRACON; MANUFACTURER_PART_NUMBER: AMPLA5030S-6R8MT; MOUSER_PART_NUMBER: 815-AMPLA5030S-6R8MT; MOUSER_PRICE-STOCK: https://www.mouser.co.uk/ProductDetail/ABRACON/AMPLA5030S-6R8MT?qs=vmHwEFxEFR8Kq8c8UlgcTw%3D%3D
L2 = LCENA2520MKT2R2M0NK:LCENA2520MKT2R2M0NK: INDUCTORS[Wire-wound Metal Power Inductors MCOIL LCEN series for Automotive Body & Chassis and Infotainment] Source: Datasheet; DESCRIPTION: INDUCTORS[Wire-wound Metal Power Inductors MCOIL LCEN series for Automotive Body & Chassis and Infotainment]; HEIGHT: mm; MANUFACTURER_NAME: TAIYO YUDEN; MANUFACTURER_PART_NUMBER: LCENA2520MKT2R2M0NK
R1-R13 = resistor:R-EU_: RESISTOR, European symbol
U1 = 2025-09-25_09-55-04_Library:TPS25921AD; COPYRIGHT: Copyright (C) 2025 Ultra Librarian. All rights reserved.; DATASHEET: https://www.ti.com/lit/gpn/tps25921a; DESCRIPTION: 4.5-V to 18-V, 90mΩ, 0.4-1.6A eFuse with auto retry fault response 8-SOIC -40 to 85; MANUFACTURER_NAME: Texas Instruments; MANUFACTURER_PART_NUMBER: TPS25921AD; REFDES: RefDes; TYPE: TYPE
U2 = LMR51430YDDCR:LMR51430YDDCR: Switching Voltage Regulators SIMPLE SWITCHER® 4.5-V to 36-V, 3-A synchronous buck converter with 40-µA IQ Source: Datasheet <https://www.ti.com/lit/ds/symlink/lmr51430.pdf?ts=1657817980313&ref_url=https%3A%2F%2Fwww.ti.com%2Fproduct%2FLMR51430%3FkeyMatch%3DLMR51430%26tisearch%3Dsearch-everything%26usecase%3DGPN>; DESCRIPTION: Switching Voltage Regulators SIMPLE SWITCHER&reg; 4.5-V to 36-V, 3-A synchronous buck converter with 40-&micro;A IQ; HEIGHT: 1.1mm; MANUFACTURER_NAME: Texas Instruments; MANUFACTURER_PART_NUMBER: LMR51430YDDCR; MOUSER_PART_NUMBER: 595-LMR51430YDDCR; MOUSER_PRICE-STOCK: https://www.mouser.co.uk/ProductDetail/Texas-Instruments/LMR51430YDDCR?qs=vvQtp7zwQdMdLcsY5sFiMg%3D%3D
U3 = AP62250WU-7:AP62250WU-7: DCDC CONV HV BUCK TSOT26 T&R 3K Source: Datasheet; DESCRIPTION: DCDC CONV HV BUCK TSOT26 T&R 3K; HEIGHT: 1mm; MANUFACTURER_NAME: Diodes Incorporated; MANUFACTURER_PART_NUMBER: AP62250WU-7; MOUSER_PART_NUMBER: 621-AP62250WU-7; MOUSER_PRICE-STOCK: https://www.mouser.co.uk/ProductDetail/Diodes-Incorporated/AP62250WU-7?qs=7MVldsJ5Uax1PUc8sdeimQ%3D%3D